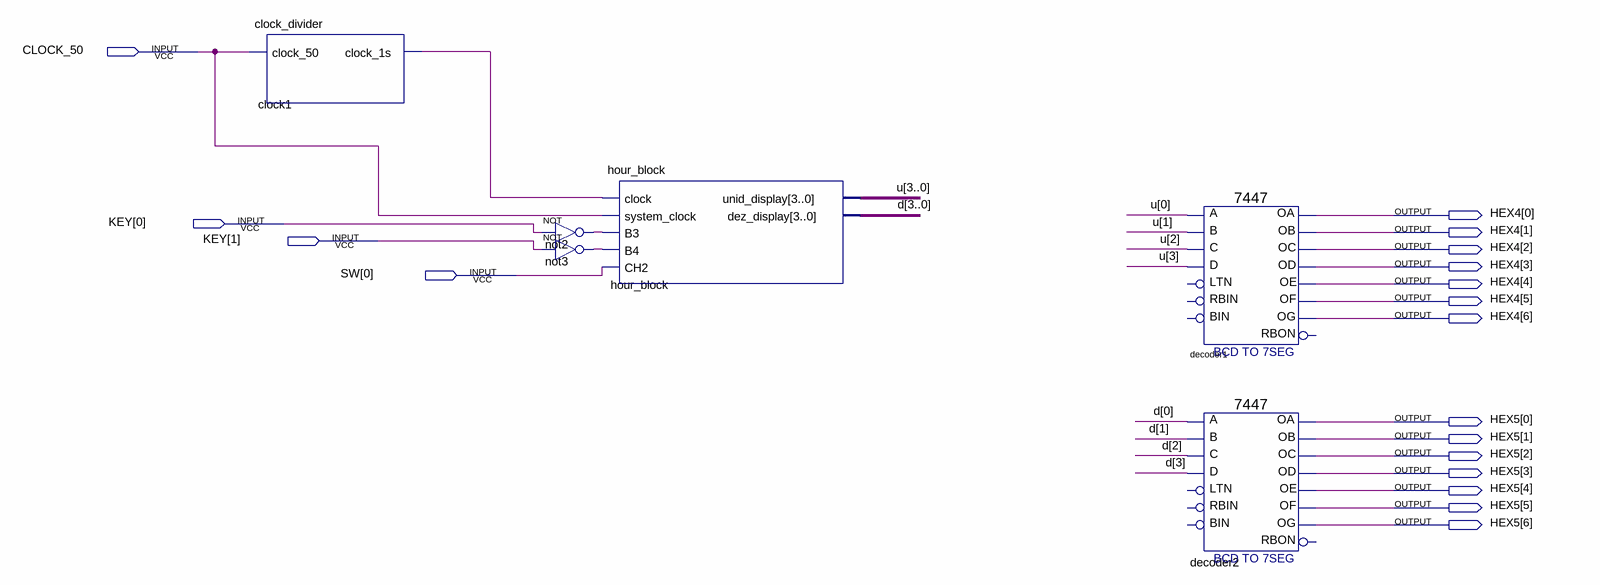
[diagram p0: schematic sheet]
// Quartus schematic hour_block_test.bdf as structural Verilog: 6 symbols, 18 pins
module hour_block_test (
  input  CLOCK_50,
  input  [1:0] KEY,
  input  [0:0] SW,
  output [6:0] HEX4,
  output [6:0] HEX5
);

  wire clock1_clock_1s, not2_out, not3_out;
  wire [3:0] d, u;

  clock_divider clock1 (.clock_50(CLOCK_50), .clock_1s(clock1_clock_1s));
  not not2 (not2_out, KEY[0]);
  not not3 (not3_out, KEY[1]);
  hour_block hour_block (
    .clock(clock1_clock_1s), .system_clock(CLOCK_50), .B3(not2_out), .B4(not3_out), .CH2(SW[0]),
    .unid_display(u), .dez_display(d));
  \7447  decoder1 (
    .B(u[1]), .C(u[2]), .D(u[3]), .A(u[0]), .OB(HEX4[1]), .OC(HEX4[2]), .OE(HEX4[4]), .OD(HEX4[3]),
    .OF(HEX4[5]), .OG(HEX4[6]), .OA(HEX4[0]));  // open: LTN, RBIN, BIN, RBON
  \7447  decoder2 (
    .B(d[1]), .C(d[2]), .D(d[3]), .A(d[0]), .OB(HEX5[1]), .OC(HEX5[2]), .OE(HEX5[4]), .OD(HEX5[3]),
    .OF(HEX5[5]), .OG(HEX5[6]), .OA(HEX5[0]));  // open: LTN, RBIN, BIN, RBON
endmodule
